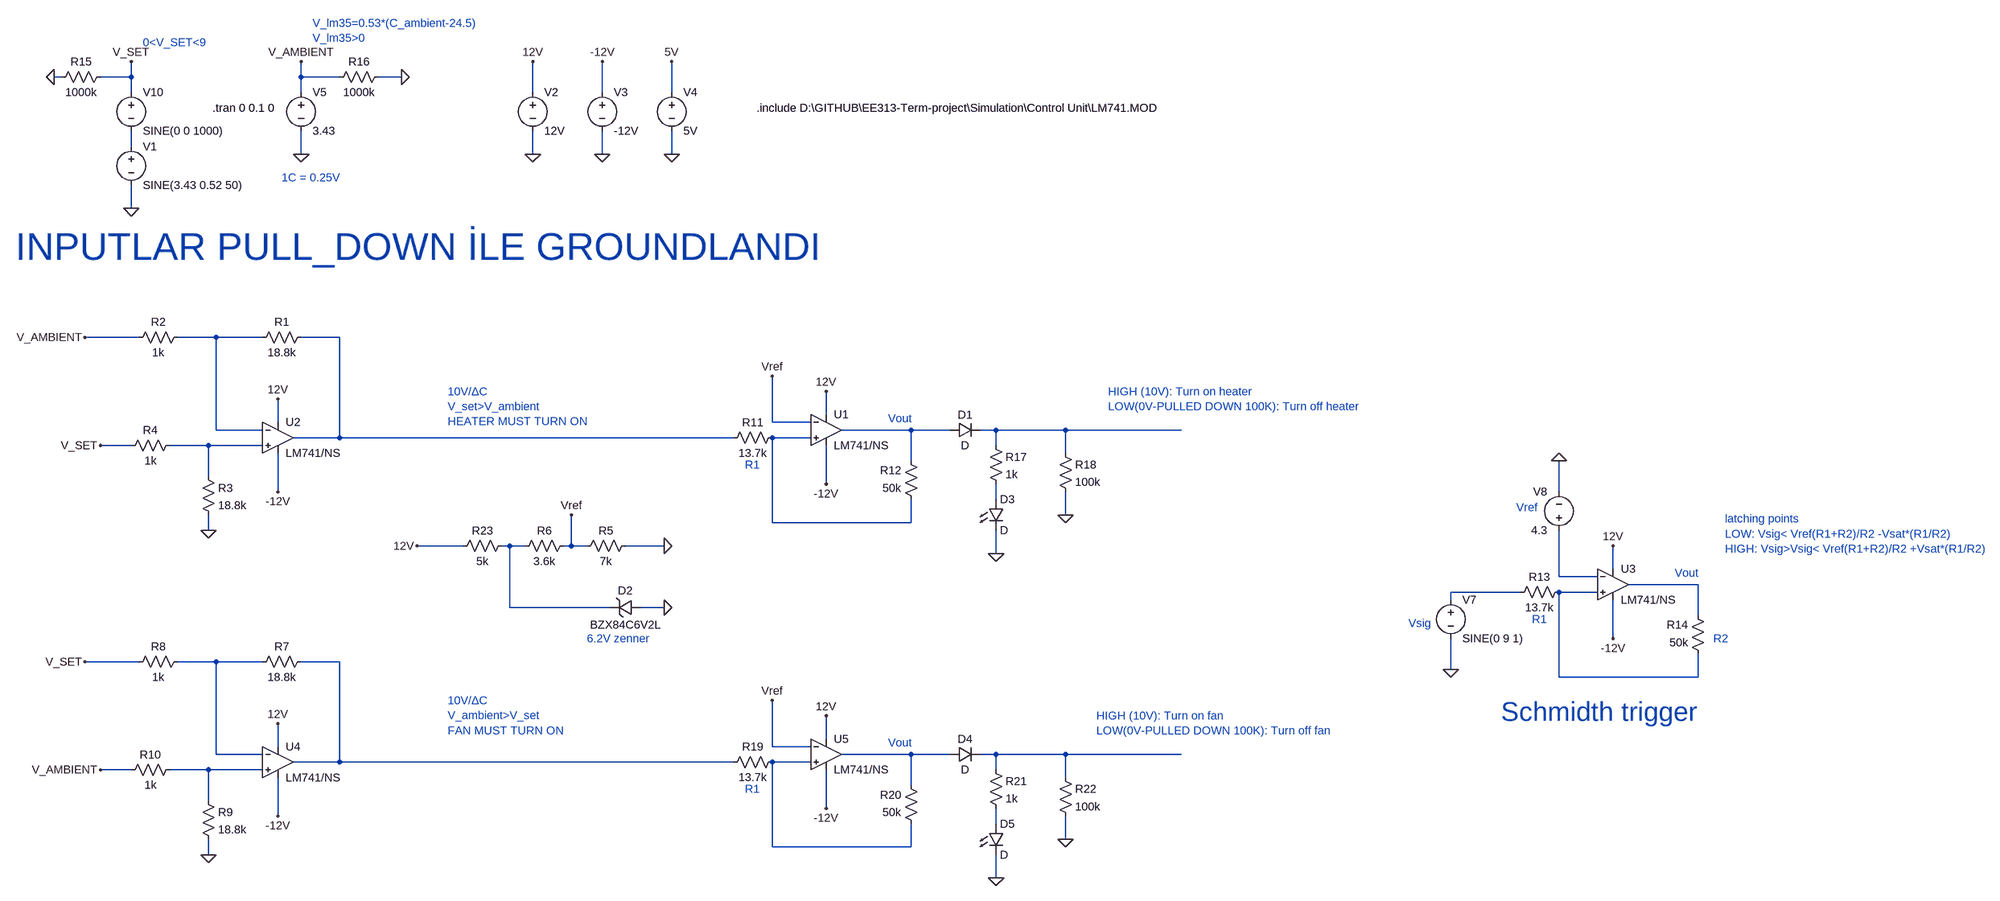
[diagram p0: schematic Control Unit.asc]
Control Unit.asc, the LTspice schematic file:
Version 4
SHEET 1 4272 2740
WIRE -1232 -512 -1248 -512
WIRE -1088 -512 -1088 -544
WIRE -1088 -512 -1152 -512
WIRE -736 -512 -736 -544
WIRE -656 -512 -736 -512
WIRE -528 -512 -576 -512
WIRE -1088 -480 -1088 -512
WIRE -736 -480 -736 -512
WIRE -256 -480 -256 -544
WIRE -112 -480 -112 -544
WIRE 32 -480 32 -544
WIRE -1088 -368 -1088 -400
WIRE -736 -352 -736 -400
WIRE -256 -352 -256 -400
WIRE -112 -352 -112 -400
WIRE 32 -352 32 -400
WIRE -1088 -240 -1088 -288
WIRE -1072 384 -1184 384
WIRE -912 384 -992 384
WIRE -816 384 -912 384
WIRE -656 384 -736 384
WIRE 352 544 352 496
WIRE -784 560 -784 512
WIRE 240 560 240 464
WIRE 320 560 240 560
WIRE -912 576 -912 384
WIRE -816 576 -912 576
WIRE 528 576 384 576
WIRE 608 576 528 576
WIRE 704 576 672 576
WIRE 848 576 704 576
WIRE 1088 576 848 576
WIRE -656 592 -656 384
WIRE -656 592 -752 592
WIRE 160 592 -656 592
WIRE 320 592 240 592
WIRE -1088 608 -1152 608
WIRE -928 608 -1008 608
WIRE -816 608 -928 608
WIRE 704 608 704 576
WIRE 848 624 848 576
WIRE 528 640 528 576
WIRE -928 672 -928 608
WIRE 352 688 352 608
WIRE -784 704 -784 624
WIRE 1952 704 1952 640
WIRE 704 720 704 688
WIRE 848 752 848 704
WIRE 240 768 240 592
WIRE 528 768 528 720
WIRE 528 768 240 768
WIRE -928 784 -928 752
WIRE -400 816 -496 816
WIRE -304 816 -320 816
WIRE -272 816 -304 816
WIRE -176 816 -176 752
WIRE -176 816 -192 816
WIRE -144 816 -176 816
WIRE 16 816 -64 816
WIRE 704 832 704 784
WIRE 2064 864 2064 816
WIRE 1952 880 1952 784
WIRE 2032 880 1952 880
WIRE 2240 896 2096 896
WIRE 1872 912 1728 912
WIRE 2032 912 1952 912
WIRE 1728 928 1728 912
WIRE -304 944 -304 816
WIRE -96 944 -304 944
WIRE 16 944 -32 944
WIRE 2240 960 2240 896
WIRE 2064 1008 2064 928
WIRE -1072 1056 -1184 1056
WIRE -912 1056 -992 1056
WIRE -816 1056 -912 1056
WIRE -656 1056 -736 1056
WIRE 1728 1072 1728 1008
WIRE 1952 1088 1952 912
WIRE 2240 1088 2240 1040
WIRE 2240 1088 1952 1088
WIRE 352 1216 352 1168
WIRE -784 1232 -784 1184
WIRE 240 1232 240 1136
WIRE 320 1232 240 1232
WIRE -912 1248 -912 1056
WIRE -816 1248 -912 1248
WIRE 528 1248 384 1248
WIRE 608 1248 528 1248
WIRE 704 1248 672 1248
WIRE 848 1248 704 1248
WIRE 1088 1248 848 1248
WIRE -656 1264 -656 1056
WIRE -656 1264 -752 1264
WIRE 160 1264 -656 1264
WIRE 320 1264 240 1264
WIRE -1088 1280 -1152 1280
WIRE -928 1280 -1008 1280
WIRE -816 1280 -928 1280
WIRE 704 1280 704 1248
WIRE 848 1296 848 1248
WIRE 528 1312 528 1248
WIRE -928 1344 -928 1280
WIRE 352 1360 352 1280
WIRE -784 1376 -784 1296
WIRE 704 1392 704 1360
WIRE 848 1424 848 1376
WIRE 240 1440 240 1264
WIRE 528 1440 528 1392
WIRE 528 1440 240 1440
WIRE -928 1456 -928 1424
WIRE 704 1504 704 1456
FLAG -1088 -240 0
FLAG -1088 -544 V_SET
FLAG -256 -352 0
FLAG -256 -544 12V
FLAG -112 -352 0
FLAG -112 -544 -12V
FLAG 32 -352 0
FLAG 32 -544 5V
FLAG -736 -352 0
FLAG -736 -544 V_AMBIENT
FLAG -784 512 12V
FLAG -784 704 -12V
FLAG -928 784 0
FLAG -1152 608 V_SET
FLAG -1184 384 V_AMBIENT
FLAG -528 -512 0
FLAG -1248 -512 0
FLAG -784 1184 12V
FLAG -784 1376 -12V
FLAG -928 1456 0
FLAG -1152 1280 V_AMBIENT
FLAG -1184 1056 V_SET
FLAG 2064 816 12V
FLAG 2064 1008 -12V
FLAG 1952 640 0
FLAG 1728 1072 0
FLAG 352 496 12V
FLAG 352 688 -12V
FLAG 704 832 0
FLAG 848 752 0
FLAG 352 1168 12V
FLAG 352 1360 -12V
FLAG 704 1504 0
FLAG 848 1424 0
FLAG 16 816 0
FLAG 16 944 0
FLAG -496 816 12V
FLAG -176 752 Vref
FLAG 240 464 Vref
FLAG 240 1136 Vref
SYMBOL voltage -1088 -384 R0
WINDOW 123 0 0 Left 0
WINDOW 39 0 0 Left 0
SYMATTR InstName V1
SYMATTR Value SINE(3.43 0.52 50)
SYMBOL voltage -256 -496 R0
WINDOW 123 0 0 Left 0
WINDOW 39 0 0 Left 0
SYMATTR InstName V2
SYMATTR Value 12V
SYMBOL voltage -112 -496 R0
WINDOW 123 0 0 Left 0
WINDOW 39 0 0 Left 0
SYMATTR InstName V3
SYMATTR Value -12V
SYMBOL voltage 32 -496 R0
WINDOW 123 0 0 Left 0
WINDOW 39 0 0 Left 0
SYMATTR InstName V4
SYMATTR Value 5V
SYMBOL voltage -736 -496 R0
WINDOW 123 0 0 Left 0
WINDOW 39 0 0 Left 0
SYMATTR InstName V5
SYMATTR Value 3.43
SYMBOL OpAmps\\opamp2 -784 528 R0
SYMATTR InstName U2
SYMATTR Value LM741/NS
SYMBOL res -720 368 R90
WINDOW 0 0 56 VBottom 2
WINDOW 3 32 56 VTop 2
SYMATTR InstName R1
SYMATTR Value 18.8k
SYMBOL res -976 368 R90
WINDOW 0 0 56 VBottom 2
WINDOW 3 32 56 VTop 2
SYMATTR InstName R2
SYMATTR Value 1k
SYMBOL res -944 656 R0
SYMATTR InstName R3
SYMATTR Value 18.8k
SYMBOL res -992 592 R90
WINDOW 0 0 56 VBottom 2
WINDOW 3 32 56 VTop 2
SYMATTR InstName R4
SYMATTR Value 1k
SYMBOL res -1136 -528 R90
WINDOW 0 0 56 VBottom 2
WINDOW 3 32 56 VTop 2
SYMATTR InstName R15
SYMATTR Value 1000k
SYMBOL res -560 -528 R90
WINDOW 0 0 56 VBottom 2
WINDOW 3 32 56 VTop 2
SYMATTR InstName R16
SYMATTR Value 1000k
SYMBOL OpAmps\\opamp2 -784 1200 R0
SYMATTR InstName U4
SYMATTR Value LM741/NS
SYMBOL res -720 1040 R90
WINDOW 0 0 56 VBottom 2
WINDOW 3 32 56 VTop 2
SYMATTR InstName R7
SYMATTR Value 18.8k
SYMBOL res -976 1040 R90
WINDOW 0 0 56 VBottom 2
WINDOW 3 32 56 VTop 2
SYMATTR InstName R8
SYMATTR Value 1k
SYMBOL res -944 1328 R0
SYMATTR InstName R9
SYMATTR Value 18.8k
SYMBOL res -992 1264 R90
WINDOW 0 0 56 VBottom 2
WINDOW 3 32 56 VTop 2
SYMATTR InstName R10
SYMATTR Value 1k
SYMBOL OpAmps\\opamp2 2064 832 R0
SYMATTR InstName U3
SYMATTR Value LM741/NS
SYMBOL res 1968 896 R90
WINDOW 0 0 56 VBottom 2
WINDOW 3 32 56 VTop 2
SYMATTR InstName R13
SYMATTR Value 13.7k
SYMBOL res 2256 1056 R180
WINDOW 0 36 76 Left 2
WINDOW 3 36 40 Left 2
SYMATTR InstName R14
SYMATTR Value 50k
SYMBOL voltage 1728 912 R0
WINDOW 123 0 0 Left 0
WINDOW 39 0 0 Left 0
SYMATTR InstName V7
SYMATTR Value SINE(0 9 1)
SYMBOL voltage 1952 800 R180
WINDOW 0 24 96 Left 2
WINDOW 3 24 16 Left 2
WINDOW 123 0 0 Left 0
WINDOW 39 0 0 Left 0
SYMATTR InstName V8
SYMATTR Value 4.3
SYMBOL OpAmps\\opamp2 352 512 R0
SYMATTR InstName U1
SYMATTR Value LM741/NS
SYMBOL res 256 576 R90
WINDOW 0 0 56 VBottom 2
WINDOW 3 32 56 VTop 2
SYMATTR InstName R11
SYMATTR Value 13.7k
SYMBOL res 544 736 R180
WINDOW 0 36 76 Left 2
WINDOW 3 36 40 Left 2
SYMATTR InstName R12
SYMATTR Value 50k
SYMBOL diode 608 592 R270
WINDOW 0 32 32 VTop 2
WINDOW 3 0 32 VBottom 2
SYMATTR InstName D1
SYMBOL LED 688 720 R0
SYMATTR InstName D3
SYMBOL res 688 592 R0
SYMATTR InstName R17
SYMATTR Value 1k
SYMBOL res 832 608 R0
SYMATTR InstName R18
SYMATTR Value 100k
SYMBOL OpAmps\\opamp2 352 1184 R0
SYMATTR InstName U5
SYMATTR Value LM741/NS
SYMBOL res 256 1248 R90
WINDOW 0 0 56 VBottom 2
WINDOW 3 32 56 VTop 2
SYMATTR InstName R19
SYMATTR Value 13.7k
SYMBOL res 544 1408 R180
WINDOW 0 36 76 Left 2
WINDOW 3 36 40 Left 2
SYMATTR InstName R20
SYMATTR Value 50k
SYMBOL diode 608 1264 R270
WINDOW 0 32 32 VTop 2
WINDOW 3 0 32 VBottom 2
SYMATTR InstName D4
SYMBOL LED 688 1392 R0
SYMATTR InstName D5
SYMBOL res 688 1264 R0
SYMATTR InstName R21
SYMATTR Value 1k
SYMBOL res 832 1280 R0
SYMATTR InstName R22
SYMATTR Value 100k
SYMBOL voltage -1088 -496 R0
WINDOW 123 0 0 Left 0
WINDOW 39 0 0 Left 0
SYMATTR InstName V10
SYMATTR Value SINE(0 0 1000)
SYMBOL res -48 800 R90
WINDOW 0 0 56 VBottom 2
WINDOW 3 32 56 VTop 2
SYMATTR InstName R5
SYMATTR Value 7k
SYMBOL zener -32 928 R90
WINDOW 0 -4 32 VBottom 2
WINDOW 3 36 32 VTop 2
SYMATTR InstName D2
SYMATTR Value BZX84C6V2L
SYMBOL res -176 800 R90
WINDOW 0 0 56 VBottom 2
WINDOW 3 32 56 VTop 2
SYMATTR InstName R6
SYMATTR Value 3.6k
SYMBOL res -304 800 R90
WINDOW 0 0 56 VBottom 2
WINDOW 3 32 56 VTop 2
SYMATTR InstName R23
SYMATTR Value 5k
TEXT 208 -448 Left 2 !.include D:\\GITHUB\\EE313-Term-project\\Simulation\\Control Unit\\LM741.MOD
TEXT -920 -448 Left 2 !.tran 0 0.1 0
TEXT -712 -624 Left 2 ;V_lm35=0.53*(C_ambient-24.5)\nV_lm35>0
TEXT -1064 -584 Left 2 ;0<V_SET<9
TEXT -776 -304 Left 2 ;1C = 0.25V
TEXT -1328 -160 Left 6 ;INPUTLAR PULL_DOWN İLE GROUNDLANDI
TEXT -432 496 Left 2 ;10V/ΔC\nV_set>V_ambient\nHEATER MUST TURN ON
TEXT -432 1136 Left 2 ;10V/ΔC\nV_ambient>V_set\nFAN MUST TURN ON
TEXT 2296 760 Left 2 ;latching points \nLOW: Vsig< Vref(R1+R2)/R2 -Vsat*(R1/R2)\nHIGH: Vsig>Vsig< Vref(R1+R2)/R2 +Vsat*(R1/R2)
TEXT 2272 1008 Left 2 ;R2
TEXT 1896 968 Left 2 ;R1
TEXT 1864 736 Left 2 ;Vref
TEXT 1640 976 Left 2 ;Vsig
TEXT 2192 872 Left 2 ;Vout
TEXT 184 648 Left 2 ;R1
TEXT 480 552 Left 2 ;Vout
TEXT 184 1320 Left 2 ;R1
TEXT 480 1224 Left 2 ;Vout
TEXT 936 496 Left 2 ;HIGH (10V): Turn on heater\nLOW(0V-PULLED DOWN 100K): Turn off heater
TEXT 912 1168 Left 2 ;HIGH (10V): Turn on fan\nLOW(0V-PULLED DOWN 100K): Turn off fan
TEXT 1832 1160 Left 5 ;Schmidth trigger
TEXT -144 1008 Left 2 ;6.2V zenner

The netlist it stands for:
* Control Unit.asc
V1 N001 0 SINE(3.43 0.52 50)
V2 12V 0 12V
V3 -12V 0 -12V
V4 5V 0 5V
V5 V_AMBIENT 0 3.43
XU2 N007 N002 12V -12V N003 LM741/NS  ; pins In+ In- V+ V- OUT
R1 N003 N002 18.8k
R2 N002 V_AMBIENT 1k
R3 N007 0 18.8k
R4 N007 V_SET 1k
R15 V_SET 0 1000k
R16 0 V_AMBIENT 1000k
XU4 N019 N014 12V -12V N015 LM741/NS  ; pins In+ In- V+ V- OUT
R7 N015 N014 18.8k
R8 N014 V_SET 1k
R9 N019 0 18.8k
R10 N019 V_AMBIENT 1k
XU3 N013 N010 12V -12V N011 LM741/NS  ; pins In+ In- V+ V- OUT
R13 N013 N012 13.7k
R14 N013 N011 50k
V7 N012 0 SINE(0 9 1)
V8 N010 0 4.3
XU1 N006 Vref 12V -12V N004 LM741/NS  ; pins In+ In- V+ V- OUT
R11 N006 N003 13.7k
R12 N006 N004 50k
D1 N004 N005 D
D3 N008 0 D
R17 N005 N008 1k
R18 N005 0 100k
XU5 N018 Vref 12V -12V N016 LM741/NS  ; pins In+ In- V+ V- OUT
R19 N018 N015 13.7k
R20 N018 N016 50k
D4 N016 N017 D
D5 N020 0 D
R21 N017 N020 1k
R22 N017 0 100k
V10 V_SET N001 SINE(0 0 1000)
R5 0 Vref 7k
D2 0 N009 BZX84C6V2L
R6 Vref N009 3.6k
R23 N009 12V 5k
.model D D
.lib standard.dio
.include D:\GITHUB\EE313-Term-project\Simulation\Control Unit\LM741.MOD
.tran 0 0.1 0
* V_lm35=0.53*(C_ambient-24.5)
* V_lm35>0
* 0<V_SET<9
* 1C = 0.25V
* INPUTLAR PULL_DOWN İLE GROUNDLANDI
* 10V/ΔC
* V_set>V_ambient
* HEATER MUST TURN ON
* 10V/ΔC
* V_ambient>V_set
* FAN MUST TURN ON
* latching points
* LOW: Vsig< Vref(R1+R2)/R2 -Vsat*(R1/R2)
* HIGH: Vsig>Vsig< Vref(R1+R2)/R2 +Vsat*(R1/R2)
* R2
* R1
* Vref
* Vsig
* Vout
* R1
* Vout
* R1
* Vout
* HIGH (10V): Turn on heater
* LOW(0V-PULLED DOWN 100K): Turn off heater
* HIGH (10V): Turn on fan
* LOW(0V-PULLED DOWN 100K): Turn off fan
* Schmidth trigger
* 6.2V zenner
.backanno
.end